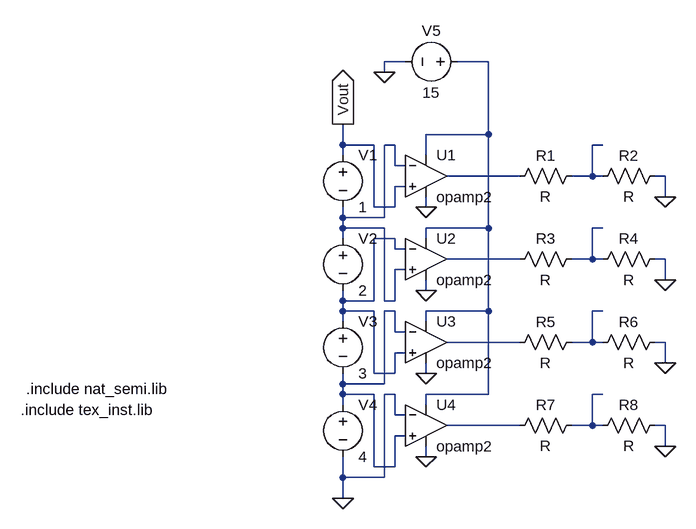
[diagram p0: schematic Draft_full.asc]
Draft_full.asc, the LTspice schematic file:
Version 4.1
SHEET 1 880 680
WIRE 240 -176 208 -176
WIRE 368 -176 320 -176
WIRE 208 -160 208 -176
WIRE 368 -64 368 -176
WIRE 368 -64 272 -64
WIRE 144 -48 144 -80
WIRE 192 -48 144 -48
WIRE 224 -48 208 -48
WIRE 544 -48 528 -48
WIRE 144 -32 144 -48
WIRE 272 -32 272 -64
WIRE 224 -16 224 -48
WIRE 240 -16 224 -16
WIRE 416 0 304 0
WIRE 528 0 528 -48
WIRE 528 0 496 0
WIRE 544 0 528 0
WIRE 640 0 624 0
WIRE 240 16 224 16
WIRE 640 32 640 0
WIRE 192 48 192 -48
WIRE 224 48 224 16
WIRE 224 48 192 48
WIRE 272 48 272 32
WIRE 144 64 144 48
WIRE 208 64 208 -48
WIRE 208 64 144 64
WIRE 144 80 144 64
WIRE 208 80 144 80
WIRE 368 80 368 -64
WIRE 368 80 272 80
WIRE 544 80 528 80
WIRE 144 96 144 80
WIRE 224 96 192 96
WIRE 272 96 272 80
WIRE 224 112 224 96
WIRE 240 112 224 112
WIRE 416 128 304 128
WIRE 528 128 528 80
WIRE 528 128 496 128
WIRE 544 128 528 128
WIRE 640 128 624 128
WIRE 240 144 224 144
WIRE 640 160 640 128
WIRE 272 176 272 160
WIRE 144 192 144 176
WIRE 192 192 192 96
WIRE 192 192 144 192
WIRE 208 192 208 80
WIRE 224 192 224 144
WIRE 224 192 208 192
WIRE 144 208 144 192
WIRE 192 208 144 208
WIRE 224 208 208 208
WIRE 368 208 368 80
WIRE 368 208 272 208
WIRE 544 208 528 208
WIRE 144 224 144 208
WIRE 272 224 272 208
WIRE 224 240 224 208
WIRE 240 240 224 240
WIRE 416 256 304 256
WIRE 528 256 528 208
WIRE 528 256 496 256
WIRE 544 256 528 256
WIRE 640 256 624 256
WIRE 240 272 224 272
WIRE 640 288 640 256
WIRE 192 304 192 208
WIRE 224 304 224 272
WIRE 224 304 192 304
WIRE 272 304 272 288
WIRE 144 320 144 304
WIRE 208 320 208 208
WIRE 208 320 144 320
WIRE 144 336 144 320
WIRE 192 336 144 336
WIRE 224 336 208 336
WIRE 368 336 368 208
WIRE 368 336 272 336
WIRE 544 336 528 336
WIRE 144 352 144 336
WIRE 272 352 272 336
WIRE 224 368 224 336
WIRE 240 368 224 368
WIRE 416 384 304 384
WIRE 528 384 528 336
WIRE 528 384 496 384
WIRE 544 384 528 384
WIRE 640 384 624 384
WIRE 240 400 224 400
WIRE 640 416 640 384
WIRE 272 432 272 416
WIRE 192 448 192 336
WIRE 224 448 224 400
WIRE 224 448 192 448
WIRE 144 464 144 432
WIRE 208 464 208 336
WIRE 208 464 144 464
WIRE 144 496 144 464
FLAG 144 496 0
FLAG 144 -80 Vout
IOPIN 144 -80 Out
FLAG 640 160 0
FLAG 640 32 0
FLAG 640 288 0
FLAG 640 416 0
FLAG 272 48 0
FLAG 272 176 0
FLAG 272 304 0
FLAG 272 432 0
FLAG 208 -160 0
SYMBOL voltage 144 -48 R0
WINDOW 123 0 0 Left 0
WINDOW 39 0 0 Left 0
SYMATTR InstName V1
SYMATTR Value 1
SYMBOL voltage 144 80 R0
SYMATTR InstName V2
SYMATTR Value 2
SYMBOL voltage 144 208 R0
SYMATTR InstName V3
SYMATTR Value 3
SYMBOL voltage 144 336 R0
SYMATTR InstName V4
SYMATTR Value 4
SYMBOL OpAmps\\opamp2 272 -64 R0
SYMATTR InstName U1
SYMBOL OpAmps\\opamp2 272 64 R0
SYMATTR InstName U2
SYMBOL OpAmps\\opamp2 272 192 R0
SYMATTR InstName U3
SYMBOL OpAmps\\opamp2 272 320 R0
SYMATTR InstName U4
SYMBOL res 512 -16 R90
WINDOW 0 0 56 VBottom 2
WINDOW 3 32 56 VTop 2
SYMATTR InstName R1
SYMBOL res 640 -16 R90
WINDOW 0 0 56 VBottom 2
WINDOW 3 32 56 VTop 2
SYMATTR InstName R2
SYMBOL res 512 112 R90
WINDOW 0 0 56 VBottom 2
WINDOW 3 32 56 VTop 2
SYMATTR InstName R3
SYMBOL res 640 112 R90
WINDOW 0 0 56 VBottom 2
WINDOW 3 32 56 VTop 2
SYMATTR InstName R4
SYMBOL res 512 240 R90
WINDOW 0 0 56 VBottom 2
WINDOW 3 32 56 VTop 2
SYMATTR InstName R5
SYMBOL res 640 240 R90
WINDOW 0 0 56 VBottom 2
WINDOW 3 32 56 VTop 2
SYMATTR InstName R6
SYMBOL res 512 368 R90
WINDOW 0 0 56 VBottom 2
WINDOW 3 32 56 VTop 2
SYMATTR InstName R7
SYMBOL res 640 368 R90
WINDOW 0 0 56 VBottom 2
WINDOW 3 32 56 VTop 2
SYMATTR InstName R8
SYMBOL voltage 336 -176 R90
WINDOW 0 -32 56 VBottom 2
WINDOW 3 32 56 VTop 2
SYMATTR InstName V5
SYMATTR Value 15
TEXT -344 328 Left 2 !.include nat_semi.lib
TEXT -352 360 Left 2 !.include tex_inst.lib

The netlist it stands for:
* Draft_full.asc
V1 Vout N002 1
V2 N002 N006 2
V3 N006 N008 3
V4 N008 0 4
X§U1 Vout N002 N001 0 N004 opamp2  ; pins In+ In- V+ V- OUT
X§U2 N002 N006 N001 0 N007 opamp2  ; pins In+ In- V+ V- OUT
X§U3 N006 N008 N001 0 N010 opamp2  ; pins In+ In- V+ V- OUT
X§U4 N008 0 N001 0 N012 opamp2  ; pins In+ In- V+ V- OUT
R1 N003 N004 R
R2 0 N003 R
R3 N005 N007 R
R4 0 N005 R
R5 N009 N010 R
R6 0 N009 R
R7 N011 N012 R
R8 0 N011 R
V5 N001 0 15
.include nat_semi.lib
.include tex_inst.lib
.backanno
.end